# EasyEDA schematic SCH_New-Project_2025-04-22.json
TITLE: MCP3008 ADC Interface with Potentiometer and LED; REV: 1.0; Date: 2025-04-22; Sheet: 1/1; Drawn By: irenstepanyan; Company: TumoLabs
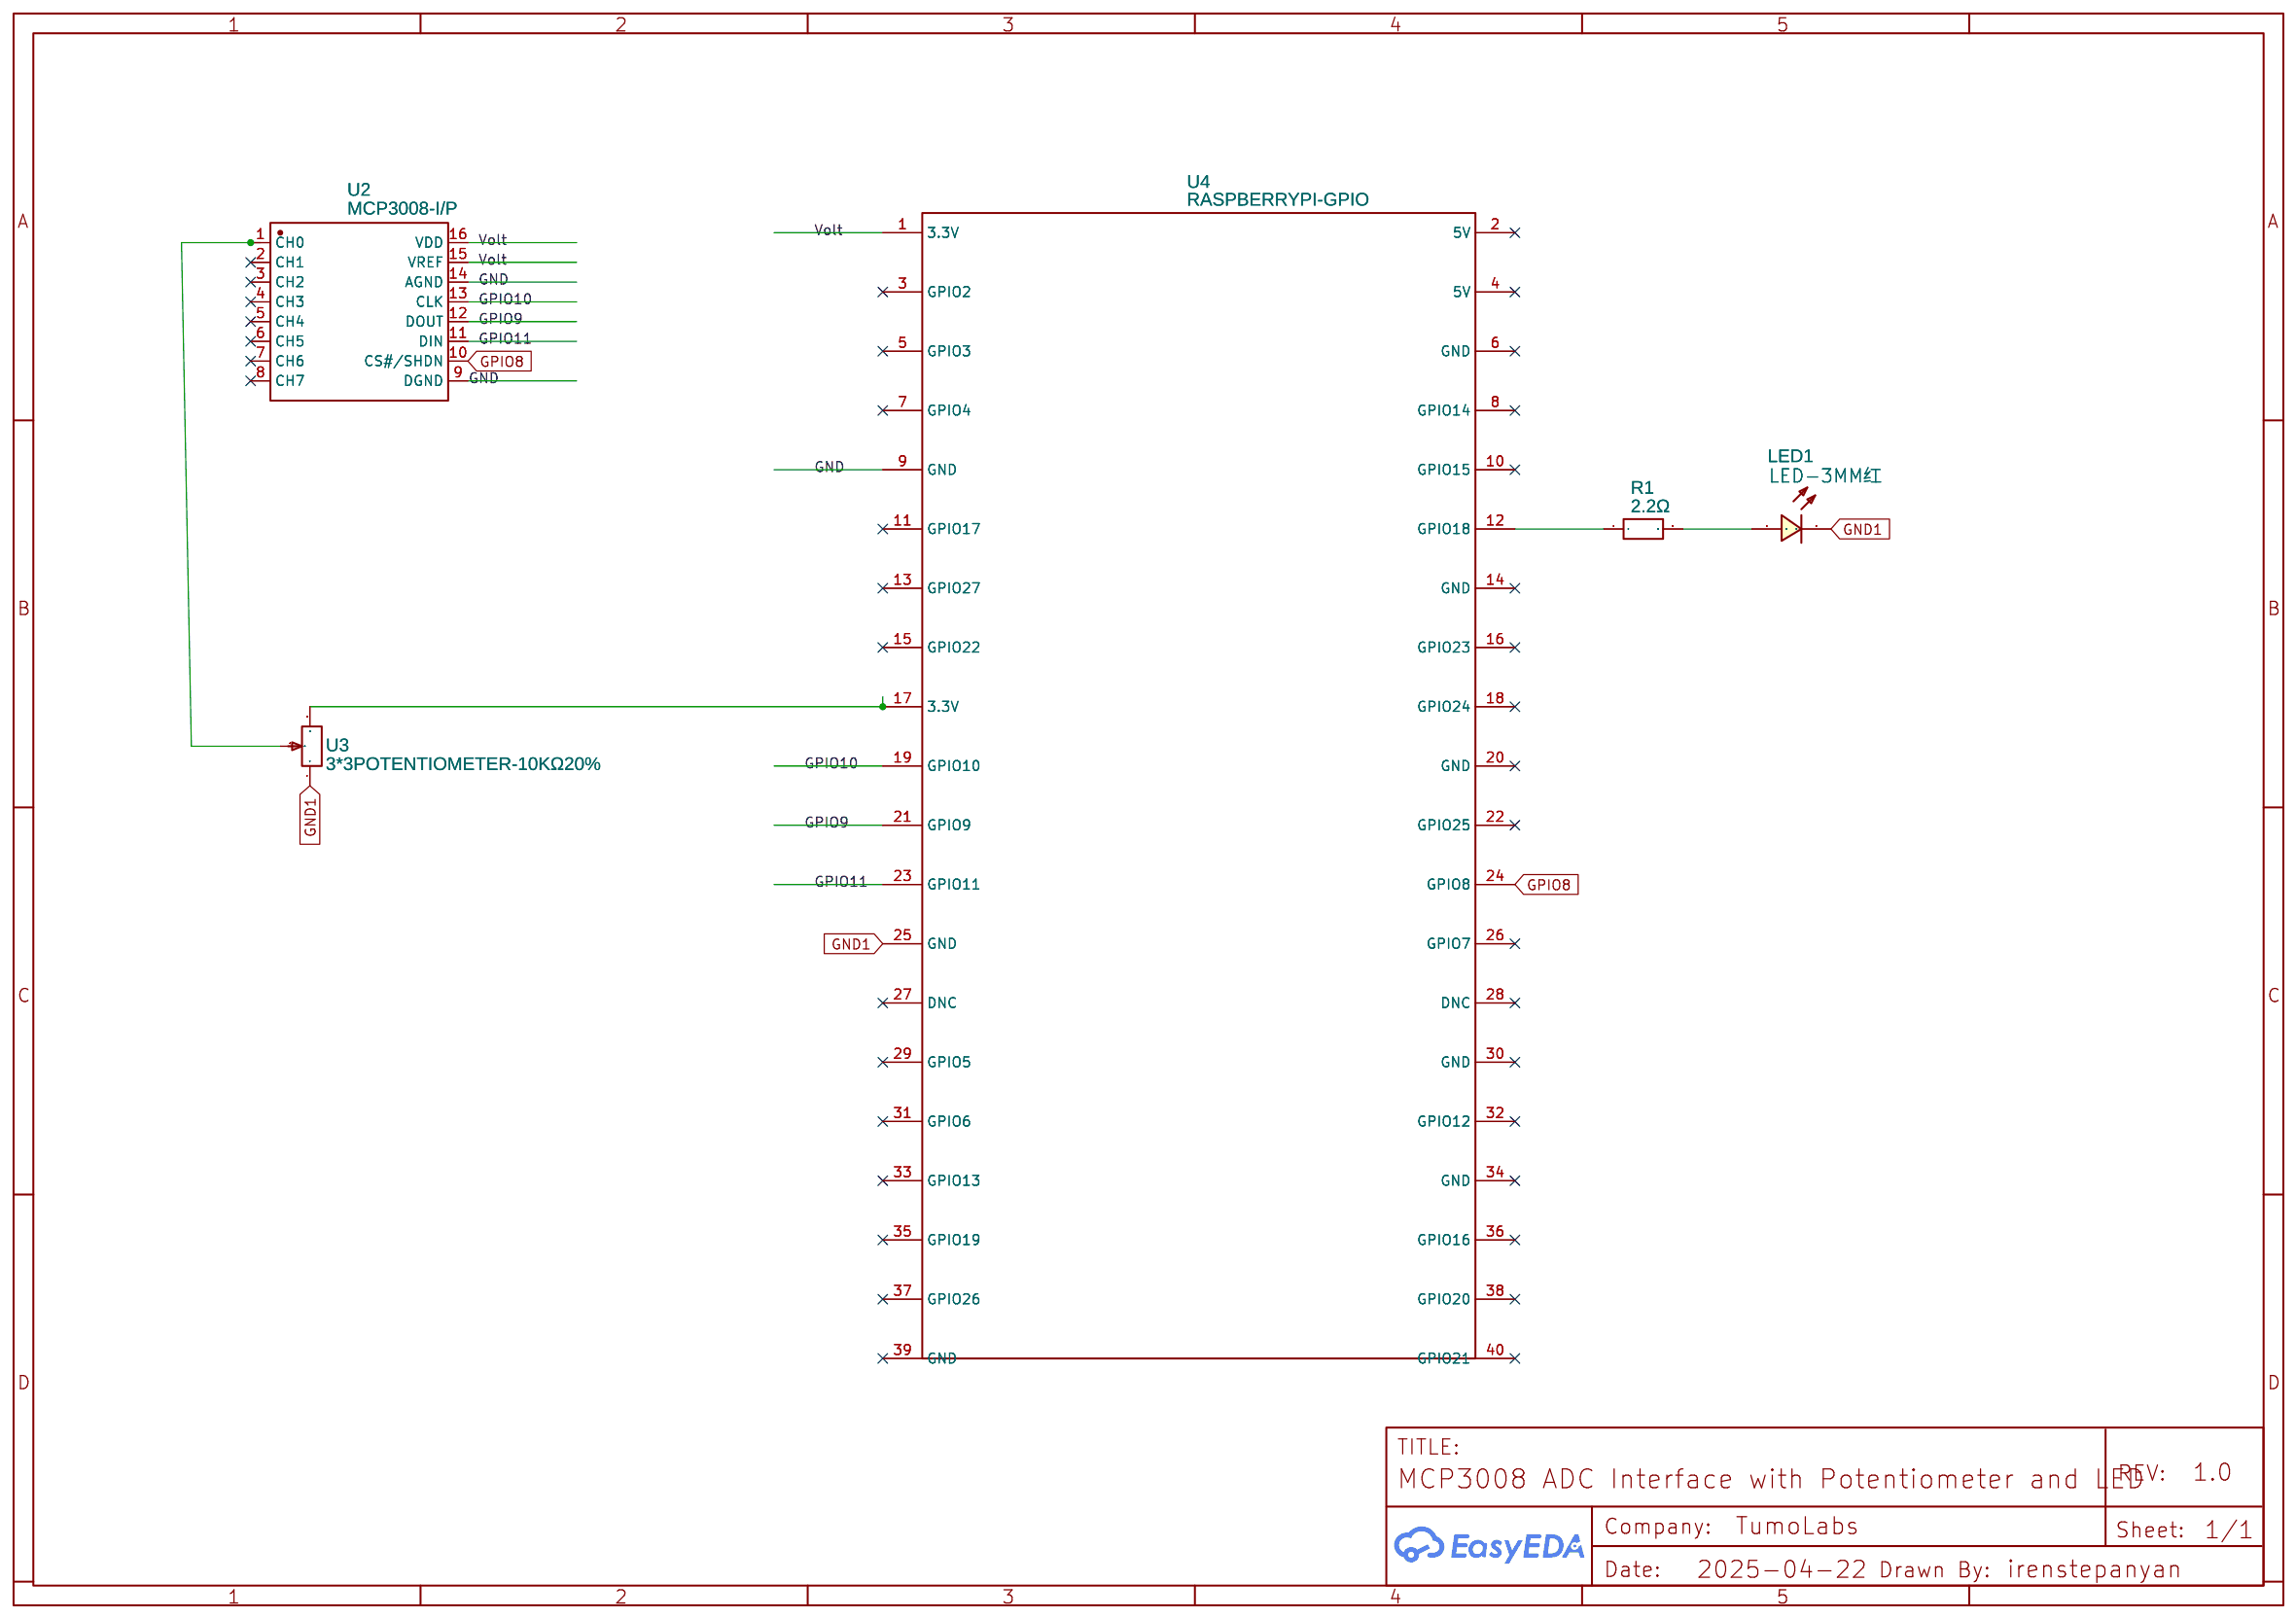
[diagram p0: schematic sheet]

## Parts
LED1  LED-3MM红  [LED-TH_LED-3MM_RED]
R1  2.2Ω  [RES-TH_L48.0-W10.0-P51.00-D0.8]
U2  MCP3008-I/P  [PDIP-16_L19.3-W6.5-P2.54-LS7.6-BL]
U3  3*3POTENTIOMETER-10KΩ20%  [RES-ADJ-SMD_VG039NCH]
U4  RASPBERRYPI-GPIO  [RASPBERRYPI-GPIO3]

## Library data of the parts
LED1 = LED-3MM红: Contributor: LCSC; Supplier: LCSC; Supplier Part: C9900003389; Manufacturer Part: LED-3mm红; Manufacturer: null
R1 = CERAMIC RESISTOR 10W/ 2,2 OHM: Supplier: LCSC; Supplier Part: C7107345; Manufacturer: Visaton; Contributor: lcsc; JLCPCB Part Class: Extended Part
U2 = MCP3008-I/P: Contributor: LCSC; Supplier: LCSC; Supplier Part: C2890491; Manufacturer: MICROCHIP(美国微芯); JLCPCB Part Class: Extended Part
U3 = 3*3POTENTIOMETER-10KΩ20%: Contributor: LCSC; Supplier: LCSC; Supplier Part: C9900010776; Manufacturer: null; Manufacturer Part: 3*3Potentiometer-10kΩ20%; JLCPCB Part Class: Extended Part
U4 = RASPBERRYPI-GPIO: Contributor: reyem10

## Nets
GND: U2.9(DGND) U2.14(AGND) U4.9(GND)
GND1: LED1.2 U3.1 U4.25(GND)
GPIO8: U2.10(CS#/SHDN) U4.24(GPIO8)
GPIO9: U2.12(DOUT) U4.21(GPIO9)
GPIO10: U2.13(CLK) U4.19(GPIO10)
GPIO11: U2.11(DIN) U4.23(GPIO11)
Volt: U2.15(VREF) U2.16(VDD) U4.1(3.3V)
Net-(LED1-1): LED1.1 R1.2
Net-(R1-1): R1.1 U4.12(GPIO18)
Net-(U2-1): U2.1(CH0) U3.2
Net-(U3-3): U3.3 U4.17(3.3V)

Not connected (* = marked no-connect by the designer): U2 2(CH1)* 3(CH2)* 4(CH3)* 5(CH4)* 6(CH5)* 7(CH6)* 8(CH7)*; U4 2(5V)* 3(GPIO2)* 4(5V)* 5(GPIO3)* 6(GND)* 7(GPIO4)* 8(GPIO14)* 10(GPIO15)* 11(GPIO17)* 13(GPIO27)* 14(GND)* 15(GPIO22)* 16(GPIO23)* 18(GPIO24)* 20(GND)* 22(GPIO25)* 26(GPIO7)* 27(DNC)* 28(DNC)* 29(GPIO5)* 30(GND)* 31(GPIO6)* 32(GPIO12)* 33(GPIO13)* 34(GND)* 35(GPIO19)* 36(GPIO16)* 37(GPIO26)* 38(GPIO20)* 39(GND)* 40(GPIO21)*
